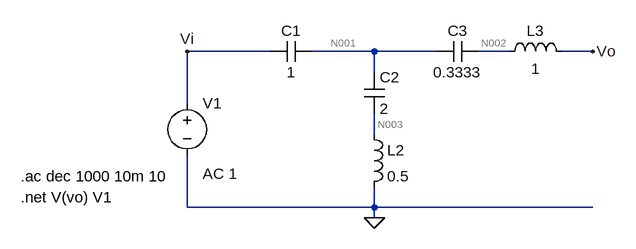
[diagram p0: schematic ej1.asc]
ej1.asc, the LTspice schematic file:
Version 4
SHEET 1 880 680
WIRE 176 112 48 112
WIRE 336 112 240 112
WIRE 432 112 336 112
WIRE 544 112 496 112
WIRE 672 112 624 112
WIRE 336 144 336 112
WIRE 48 192 48 112
WIRE 336 240 336 208
WIRE 48 352 48 272
WIRE 336 352 336 320
WIRE 336 352 48 352
WIRE 672 352 336 352
WIRE 336 368 336 352
FLAG 336 368 0
FLAG 48 112 Vi
FLAG 672 112 Vo
SYMBOL voltage 48 176 R0
WINDOW 123 24 124 Left 2
WINDOW 39 0 0 Left 0
SYMATTR InstName V1
SYMATTR Value ""
SYMATTR Value2 AC 1
SYMBOL cap 240 96 R90
WINDOW 0 0 32 VBottom 2
WINDOW 3 32 32 VTop 2
SYMATTR InstName C1
SYMATTR Value 1
SYMBOL ind 320 224 R0
SYMATTR InstName L2
SYMATTR Value 0.5
SYMATTR SpiceLine Rser=0
SYMBOL cap 320 144 R0
SYMATTR InstName C2
SYMATTR Value 2
SYMBOL ind 528 128 R270
WINDOW 0 32 56 VTop 2
WINDOW 3 5 56 VBottom 2
SYMATTR InstName L3
SYMATTR Value 1
SYMATTR SpiceLine Rser=0
SYMBOL cap 496 96 R90
WINDOW 0 0 32 VBottom 2
WINDOW 3 32 32 VTop 2
SYMATTR InstName C3
SYMATTR Value 0.3333
TEXT -208 304 Left 2 !.ac dec 1000 10m 10
TEXT -208 336 Left 2 !.net V(vo) V1

The netlist it stands for:
* ej1.asc
V1 Vi 0 AC 1
C1 N001 Vi 1
L2 N003 0 0.5 Rser=0
C2 N001 N003 2
L3 N002 Vo 1 Rser=0
C3 N002 N001 0.3333
.ac dec 1000 10m 10
.net V(vo) V1
.backanno
.end

* Results of the author's LTspice run, read from the files saved beside the schematic
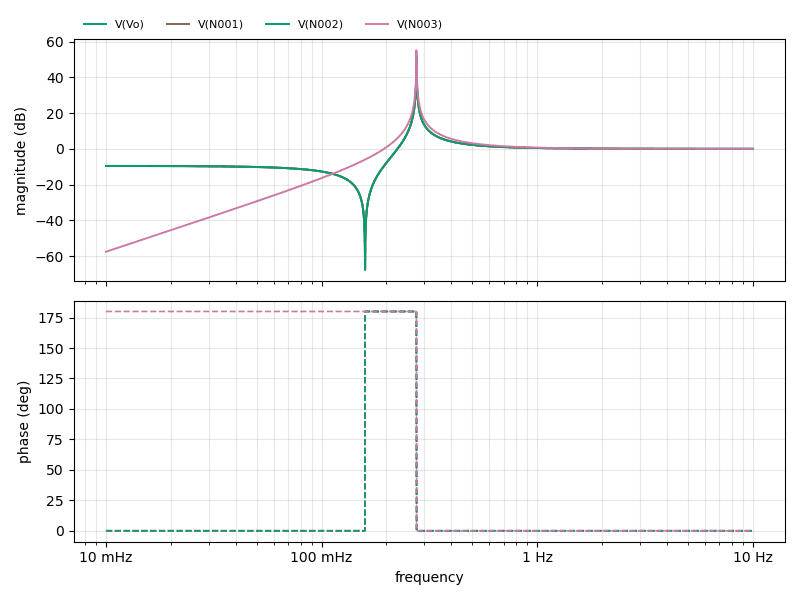
[diagram p1: AC Analysis of ej1.asc, plotted from the saved traces]
* AC Analysis, 1 run:
*   V(Vo): -9.57 dB at 10 mHz, 0.00 dB at 10 Hz, peak 51.59 dB at 275.4 mHz, 3 dB below the peak at 275.3 mHz and 275.9 mHz
*   V(N001): -9.57 dB at 10 mHz, 0.00 dB at 10 Hz, peak 51.59 dB at 275.4 mHz, 3 dB below the peak at 275.3 mHz and 275.9 mHz
*   V(N002): -9.57 dB at 10 mHz, 0.00 dB at 10 Hz, peak 51.59 dB at 275.4 mHz, 3 dB below the peak at 275.3 mHz and 275.9 mHz
*   V(N003): -57.60 dB at 10 mHz, 0.01 dB at 10 Hz, peak 55.11 dB at 275.4 mHz, 3 dB below the peak at 275.3 mHz and 275.9 mHz